# EAGLE board speakerbadge (EAGLE 5.11), part 1 of 2
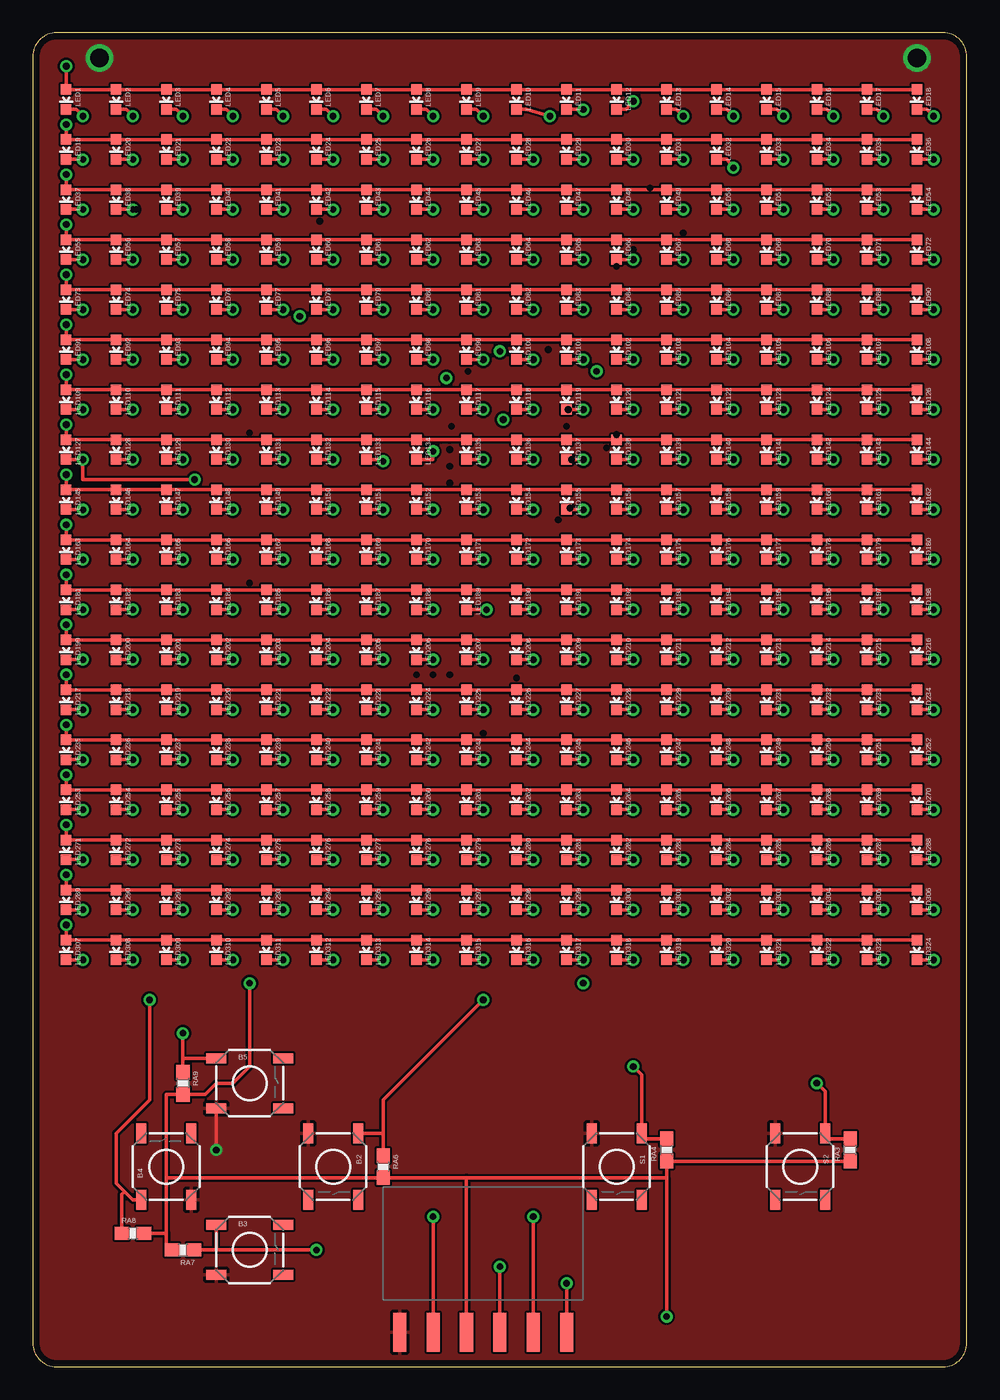
[diagram p2: board, top side]
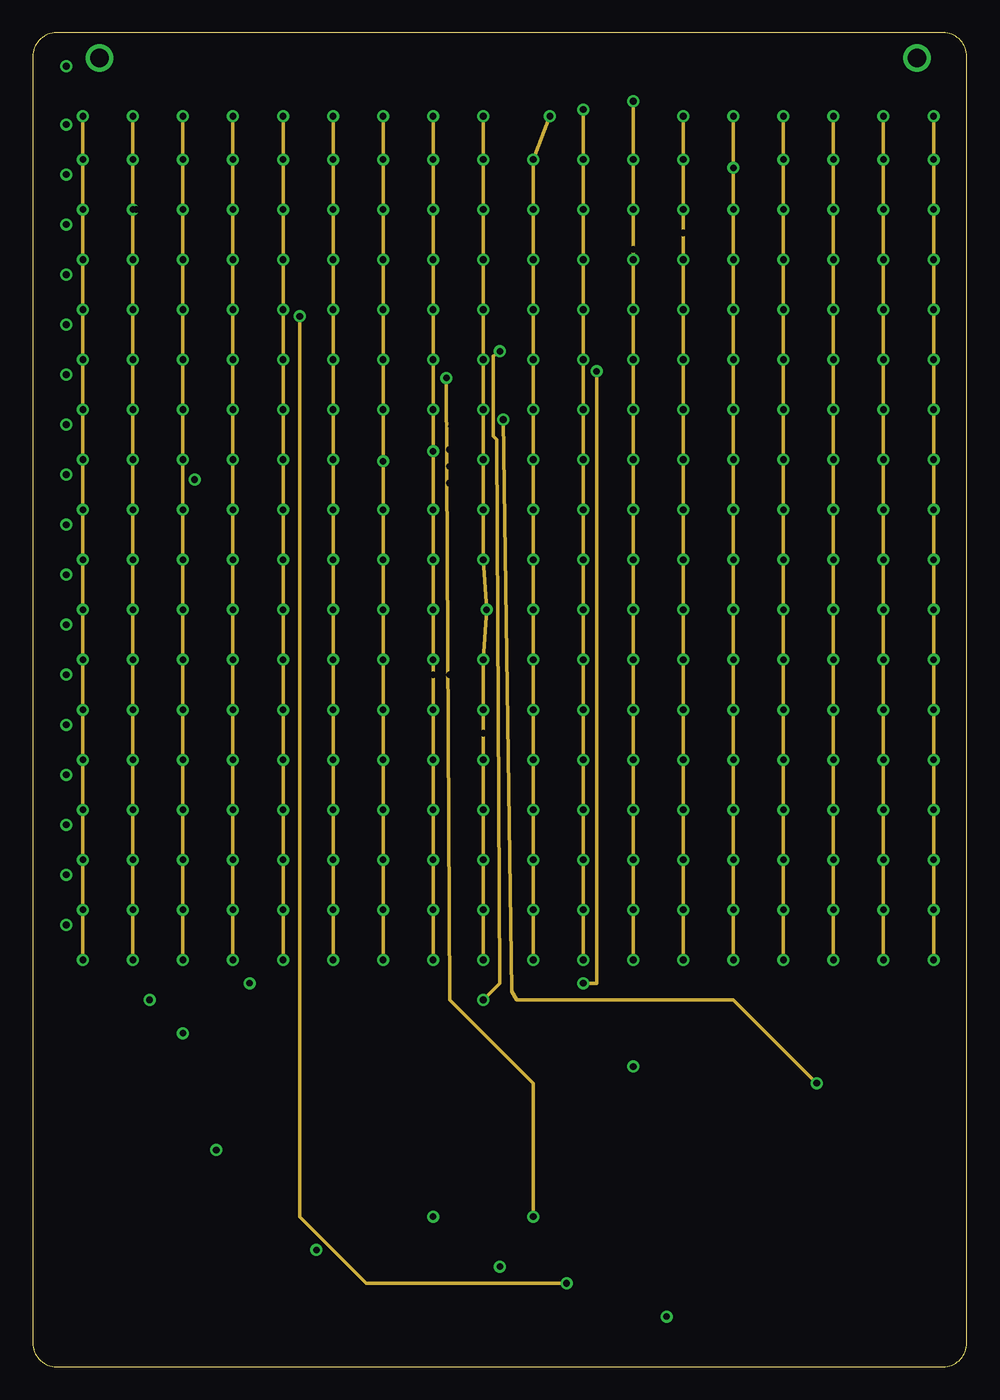
[diagram p3: board, inner layer gnd]
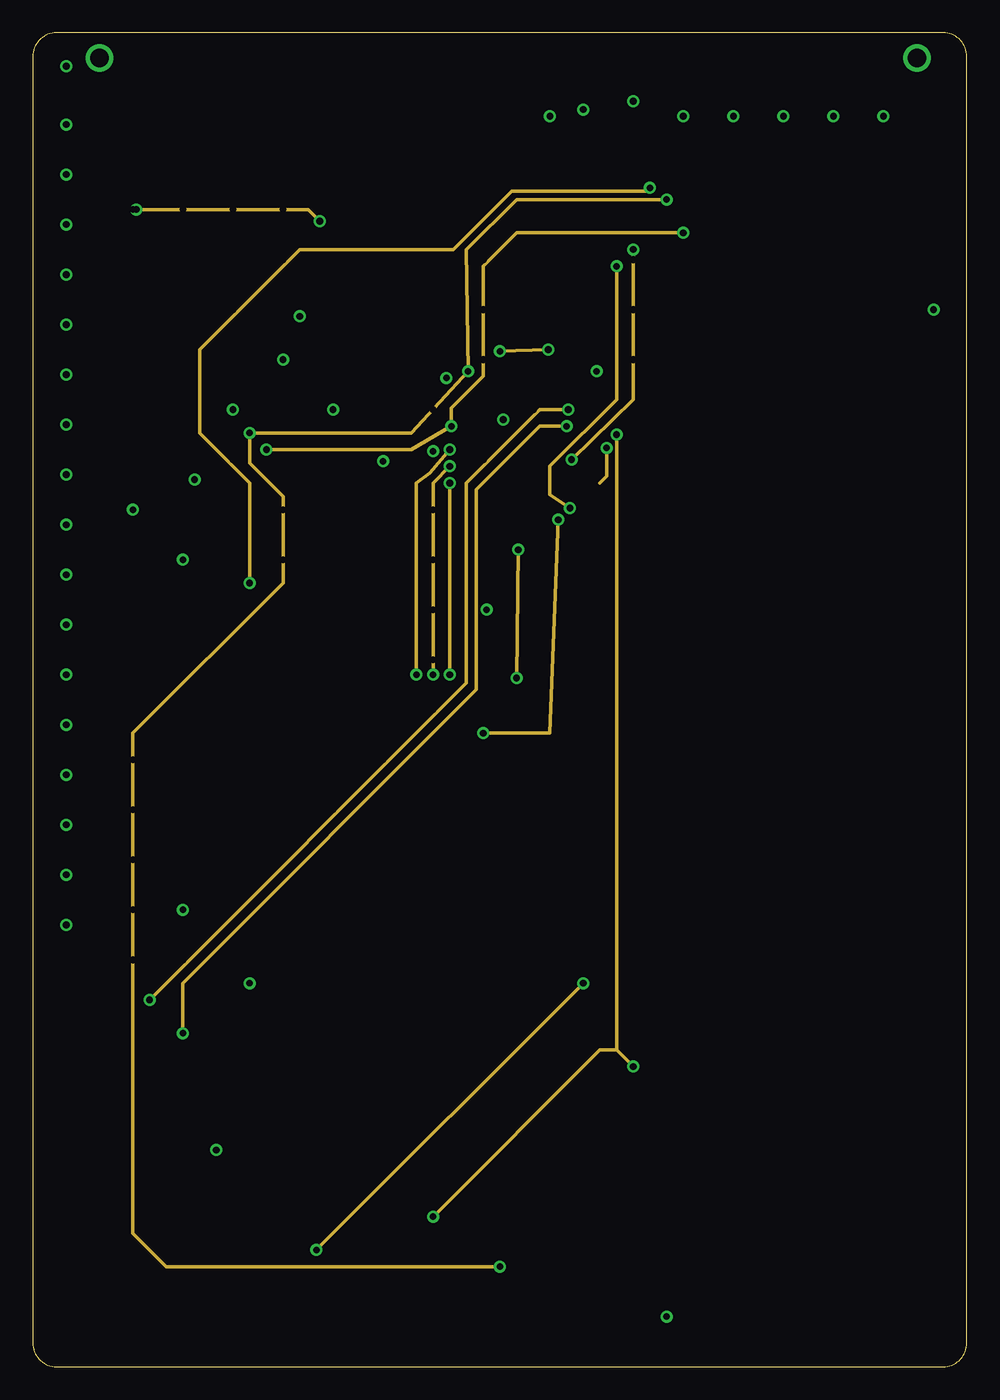
[diagram p4: board, inner layer vcc]
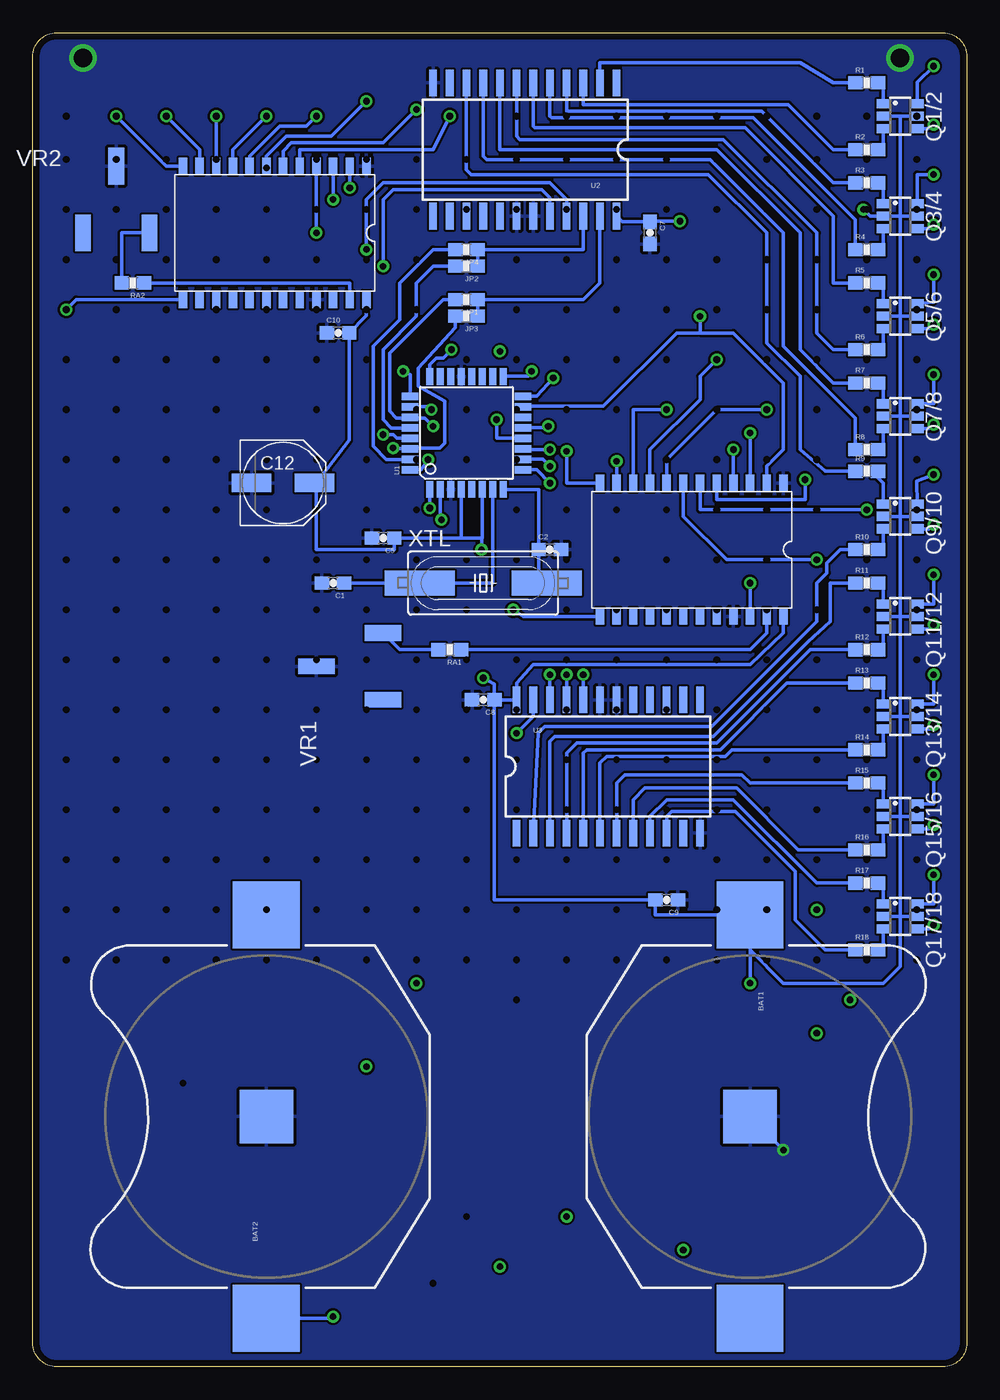
[diagram p5: board, bottom side, seen from below]

Size 71.12 x 101.6 mm. Coordinates in mm from the lower left corner, seen from the top.
Outline: 69.32,0 arc90 71.12,1.8 71.12,99.8 arc90 69.32,101.6 1.8,101.6 arc90 0,99.8 0,1.8 arc90 1.8,0 69.32,0
Copper layers ((1*2)*(3*16)): Top 0.0356mm / dielectric 1.5011mm / gnd 0.0356mm / dielectric 0.1499mm / vcc 0.0356mm / dielectric 0.2007mm / Bottom 0.0356mm
Design rules "SilverCircuits4layer": minimum track width 7mil, minimum drill 14mil, track to track 7mil, track to pad 7mil, pad to pad 7mil, via to via 7mil, smd to smd 0mil, copper to edge 20mil, drill to drill 8mil, minimum pad ring 10mil, minimum via ring 8mil, stop-mask expansion 4mil, vias tented up to drill 0mil, thermal gap 10mil

## Footprints (pad centres in the part's own frame; a part is rotated, then mirrored left to right if it is on the bottom)
TACTILE_SWITCH_SMD = smd 1.524 x 0.762: 1 -2.54,1.905; 2 2.54,1.905; 3 -2.54,-1.905; 4 2.54,-1.905
NSL_SPARKFUN_BATTCON_245MM = smd 5.08 x 5.08: 1 -15.367,0; 3 15.367,0 | smd 4.064 x 4.064: 2 0,0
SPARKFUN_0603-CAP = smd 1.1 x 1: 1 -0.85,0; 2 0.85,0
PANASONIC_D = smd 3 x 1.4: + 2.4,0; - -2.4,0
SPARKFUN_0603-RES = smd 1.1 x 1: 1 -0.85,0; 2 0.85,0
1X06-SMD_EDGE = smd 1 x 3: 1 0,-0.08; 2 2.54,-0.08; 3 5.08,-0.08; 4 7.62,-0.08; 5 10.16,-0.08; 6 12.7,-0.08
NSL_SPARKFUN_LED-0603 = smd 0.8 x 0.8: A 0,-0.75; C 0,0.75
SSOT-6 = smd 0.69 x 0.99: 1 -0.95,-1.3; 2 0,-1.3; 3 0.95,-1.3; 4 0.95,1.3; 5 0,1.3; 6 -0.95,1.3
TQFP32-08 = smd 1.27 x 0.559: 1 -4.293,2.8; 2 -4.293,2; 3 -4.293,1.2; 4 -4.293,0.4; 5 -4.293,-0.4; 6 -4.293,-1.2; 7 -4.293,-2; 8 -4.293,-2.8; 17 4.293,-2.8; 18 4.293,-2; 19 4.293,-1.2; 20 4.293,-0.4; 21 4.293,0.4; 22 4.293,1.2; 23 4.293,2; 24 4.293,2.8 | smd 0.559 x 1.27: 9 -2.8,-4.293; 10 -2,-4.293; 11 -1.2,-4.293; 12 -0.4,-4.293; 13 0.4,-4.293; 14 1.2,-4.293; 15 2,-4.293; 16 2.8,-4.293; 25 2.8,4.293; 26 2,4.293; 27 1.2,4.293; 28 0.4,4.293; 29 -0.4,4.293; 30 -1.2,4.293; 31 -2,4.293; 32 -2.8,4.293
SO-24DW = smd 0.584 x 2.032: 1 -6.35,-5.08; 2 -5.08,-5.08; 3 -3.81,-5.08; 4 -2.54,-5.08; 5 -1.27,-5.08; 6 0,-5.08; 7 1.27,-5.08; 8 2.54,-5.08; 9 3.81,-5.08; 10 5.08,-5.08; 11 6.35,-5.08; 12 7.62,-5.08; 13 7.62,5.08; 14 6.35,5.08; 15 5.08,5.08; 16 3.81,5.08; 17 2.54,5.08; 18 1.27,5.08; 19 0,5.08; 20 -1.27,5.08; 21 -2.54,5.08; 22 -3.81,5.08; 23 -5.08,5.08; 24 -6.35,5.08
STP16DP05MTR = smd 0.635 x 1.27: 1 -7.62,-5.08; 2 -6.35,-5.08; 3 -5.08,-5.08; 4 -3.81,-5.08; 5 -2.54,-5.08; 6 -1.27,-5.08; 7 0,-5.08; 8 1.27,-5.08; 9 2.54,-5.08; 10 3.81,-5.08; 11 5.08,-5.08; 12 6.35,-5.08; 13 6.35,5.08; 14 5.08,5.08; 15 3.81,5.08; 16 2.54,5.08; 17 1.27,5.08; 18 0,5.08; 19 -1.27,5.08; 20 -2.54,5.08; 21 -3.81,5.08; 22 -5.08,5.08; 23 -6.35,5.08; 24 -7.62,5.08
3269W = smd 1.19 x 2.79: 1 -2.54,-2.54; 2 0,2.54; 3 2.54,-2.54
HC49UP = smd 5.334 x 1.93: 1 -4.826,0; 2 4.826,0

## Placement (x,y rotation side)
B2  SWITCH-MOM-2SMD  [TACTILE_SWITCH_SMD]  22.86,15.24 270 top
B3  SWITCH-MOM-2SMD  [TACTILE_SWITCH_SMD]  16.51,8.89 0 top
B4  SWITCH-MOM-2SMD  [TACTILE_SWITCH_SMD]  10.16,15.24 90 top
B5  SWITCH-MOM-2SMD  [TACTILE_SWITCH_SMD]  16.51,21.59 0 top
BAT1  [NSL_SPARKFUN_BATTCON_245MM]  16.51,19.05 270 bottom
BAT2  [NSL_SPARKFUN_BATTCON_245MM]  53.34,19.05 90 bottom
C1  18pF  [SPARKFUN_0603-CAP]  48.26,59.69 180 bottom
C2  18pF  [SPARKFUN_0603-CAP]  31.75,62.23 0 bottom
C5  .1uF  [SPARKFUN_0603-CAP]  44.45,63.12 180 bottom
C7  .1uF  [SPARKFUN_0603-CAP]  24.13,86.36 270 bottom
C8  .1uF  [SPARKFUN_0603-CAP]  36.83,50.8 180 bottom
C9  .1uF  [SPARKFUN_0603-CAP]  22.86,35.56 180 bottom
C10  .1uF  [SPARKFUN_0603-CAP]  47.88,78.74 0 bottom
C12  100uF  [PANASONIC_D]  52.07,67.31 0 bottom
JP1  0ohm  [SPARKFUN_0603-RES]  38.1,81.28 180 bottom
JP2  0ohm  [SPARKFUN_0603-RES]  38.1,83.82 180 bottom
JP3  0ohm  [SPARKFUN_0603-RES]  38.1,80.01 180 bottom
JP4  0ohm  [SPARKFUN_0603-RES]  38.1,85.09 180 bottom
JP5  [1X06-SMD_EDGE]  40.64,2.54 180 top
LED1  [NSL_SPARKFUN_LED-0603]  2.54,96.52 180 top
LED2  [NSL_SPARKFUN_LED-0603]  6.35,96.52 180 top
LED3  [NSL_SPARKFUN_LED-0603]  10.16,96.52 180 top
LED4  [NSL_SPARKFUN_LED-0603]  13.97,96.52 180 top
LED5  [NSL_SPARKFUN_LED-0603]  17.78,96.52 180 top
LED6  [NSL_SPARKFUN_LED-0603]  21.59,96.52 180 top
LED7  [NSL_SPARKFUN_LED-0603]  25.4,96.52 180 top
LED8  [NSL_SPARKFUN_LED-0603]  29.21,96.52 180 top
LED9  [NSL_SPARKFUN_LED-0603]  33.02,96.52 180 top
LED10  [NSL_SPARKFUN_LED-0603]  36.83,96.52 180 top
LED11  [NSL_SPARKFUN_LED-0603]  40.64,96.52 180 top
LED12  [NSL_SPARKFUN_LED-0603]  44.45,96.52 180 top
LED13  [NSL_SPARKFUN_LED-0603]  48.26,96.52 180 top
LED14  [NSL_SPARKFUN_LED-0603]  52.07,96.52 180 top
LED15  [NSL_SPARKFUN_LED-0603]  55.88,96.52 180 top
LED16  [NSL_SPARKFUN_LED-0603]  59.69,96.52 180 top
LED17  [NSL_SPARKFUN_LED-0603]  63.5,96.52 180 top
LED18  [NSL_SPARKFUN_LED-0603]  67.31,96.52 180 top
LED19  [NSL_SPARKFUN_LED-0603]  2.54,92.71 180 top
LED20  [NSL_SPARKFUN_LED-0603]  6.35,92.71 180 top
LED21  [NSL_SPARKFUN_LED-0603]  10.16,92.71 180 top
LED22  [NSL_SPARKFUN_LED-0603]  13.97,92.71 180 top
LED23  [NSL_SPARKFUN_LED-0603]  17.78,92.71 180 top
LED24  [NSL_SPARKFUN_LED-0603]  21.59,92.71 180 top
LED25  [NSL_SPARKFUN_LED-0603]  25.4,92.71 180 top
LED26  [NSL_SPARKFUN_LED-0603]  29.21,92.71 180 top
LED27  [NSL_SPARKFUN_LED-0603]  33.02,92.71 180 top
LED28  [NSL_SPARKFUN_LED-0603]  36.83,92.71 180 top
LED29  [NSL_SPARKFUN_LED-0603]  40.64,92.71 180 top
LED30  [NSL_SPARKFUN_LED-0603]  44.45,92.71 180 top
LED31  [NSL_SPARKFUN_LED-0603]  48.26,92.71 180 top
LED32  [NSL_SPARKFUN_LED-0603]  52.07,92.71 180 top
LED33  [NSL_SPARKFUN_LED-0603]  55.88,92.71 180 top
LED34  [NSL_SPARKFUN_LED-0603]  59.69,92.71 180 top
LED35  [NSL_SPARKFUN_LED-0603]  63.5,92.71 180 top
LED36  [NSL_SPARKFUN_LED-0603]  67.31,92.71 180 top
LED37  [NSL_SPARKFUN_LED-0603]  2.54,88.9 180 top
LED38  [NSL_SPARKFUN_LED-0603]  6.35,88.9 180 top
LED39  [NSL_SPARKFUN_LED-0603]  10.16,88.9 180 top
LED40  [NSL_SPARKFUN_LED-0603]  13.97,88.9 180 top
LED41  [NSL_SPARKFUN_LED-0603]  17.78,88.9 180 top
LED42  [NSL_SPARKFUN_LED-0603]  21.59,88.9 180 top
LED43  [NSL_SPARKFUN_LED-0603]  25.4,88.9 180 top
LED44  [NSL_SPARKFUN_LED-0603]  29.21,88.9 180 top
LED45  [NSL_SPARKFUN_LED-0603]  33.02,88.9 180 top
LED46  [NSL_SPARKFUN_LED-0603]  36.83,88.9 180 top
LED47  [NSL_SPARKFUN_LED-0603]  40.64,88.9 180 top
LED48  [NSL_SPARKFUN_LED-0603]  44.45,88.9 180 top
LED49  [NSL_SPARKFUN_LED-0603]  48.26,88.9 180 top
LED50  [NSL_SPARKFUN_LED-0603]  52.07,88.9 180 top
LED51  [NSL_SPARKFUN_LED-0603]  55.88,88.9 180 top
LED52  [NSL_SPARKFUN_LED-0603]  59.69,88.9 180 top
LED53  [NSL_SPARKFUN_LED-0603]  63.5,88.9 180 top
LED54  [NSL_SPARKFUN_LED-0603]  67.31,88.9 180 top
LED55  [NSL_SPARKFUN_LED-0603]  2.54,85.09 180 top
LED56  [NSL_SPARKFUN_LED-0603]  6.35,85.09 180 top
LED57  [NSL_SPARKFUN_LED-0603]  10.16,85.09 180 top
LED58  [NSL_SPARKFUN_LED-0603]  13.97,85.09 180 top
LED59  [NSL_SPARKFUN_LED-0603]  17.78,85.09 180 top
LED60  [NSL_SPARKFUN_LED-0603]  21.59,85.09 180 top
LED61  [NSL_SPARKFUN_LED-0603]  25.4,85.09 180 top
LED62  [NSL_SPARKFUN_LED-0603]  29.21,85.09 180 top
LED63  [NSL_SPARKFUN_LED-0603]  33.02,85.09 180 top
LED64  [NSL_SPARKFUN_LED-0603]  36.83,85.09 180 top
LED65  [NSL_SPARKFUN_LED-0603]  40.64,85.09 180 top
LED66  [NSL_SPARKFUN_LED-0603]  44.45,85.09 180 top
LED67  [NSL_SPARKFUN_LED-0603]  48.26,85.09 180 top
LED68  [NSL_SPARKFUN_LED-0603]  52.07,85.09 180 top
LED69  [NSL_SPARKFUN_LED-0603]  55.88,85.09 180 top
LED70  [NSL_SPARKFUN_LED-0603]  59.69,85.09 180 top
LED71  [NSL_SPARKFUN_LED-0603]  63.5,85.09 180 top
LED72  [NSL_SPARKFUN_LED-0603]  67.31,85.09 180 top
LED73  [NSL_SPARKFUN_LED-0603]  2.54,81.28 180 top
LED74  [NSL_SPARKFUN_LED-0603]  6.35,81.28 180 top
LED75  [NSL_SPARKFUN_LED-0603]  10.16,81.28 180 top
LED76  [NSL_SPARKFUN_LED-0603]  13.97,81.28 180 top
LED77  [NSL_SPARKFUN_LED-0603]  17.78,81.28 180 top
LED78  [NSL_SPARKFUN_LED-0603]  21.59,81.28 180 top
LED79  [NSL_SPARKFUN_LED-0603]  25.4,81.28 180 top
LED80  [NSL_SPARKFUN_LED-0603]  29.21,81.28 180 top
LED81  [NSL_SPARKFUN_LED-0603]  33.02,81.28 180 top
LED82  [NSL_SPARKFUN_LED-0603]  36.83,81.28 180 top
LED83  [NSL_SPARKFUN_LED-0603]  40.64,81.28 180 top
LED84  [NSL_SPARKFUN_LED-0603]  44.45,81.28 180 top
LED85  [NSL_SPARKFUN_LED-0603]  48.26,81.28 180 top
LED86  [NSL_SPARKFUN_LED-0603]  52.07,81.28 180 top
LED87  [NSL_SPARKFUN_LED-0603]  55.88,81.28 180 top
LED88  [NSL_SPARKFUN_LED-0603]  59.69,81.28 180 top
LED89  [NSL_SPARKFUN_LED-0603]  63.5,81.28 180 top
LED90  [NSL_SPARKFUN_LED-0603]  67.31,81.28 180 top
LED91  [NSL_SPARKFUN_LED-0603]  2.54,77.47 180 top
LED92  [NSL_SPARKFUN_LED-0603]  6.35,77.47 180 top
LED93  [NSL_SPARKFUN_LED-0603]  10.16,77.47 180 top
LED94  [NSL_SPARKFUN_LED-0603]  13.97,77.47 180 top
LED95  [NSL_SPARKFUN_LED-0603]  17.78,77.47 180 top
LED96  [NSL_SPARKFUN_LED-0603]  21.59,77.47 180 top
LED97  [NSL_SPARKFUN_LED-0603]  25.4,77.47 180 top
LED98  [NSL_SPARKFUN_LED-0603]  29.21,77.47 180 top
LED99  [NSL_SPARKFUN_LED-0603]  33.02,77.47 180 top
LED100  [NSL_SPARKFUN_LED-0603]  36.83,77.47 180 top
LED101  [NSL_SPARKFUN_LED-0603]  40.64,77.47 180 top
LED102  [NSL_SPARKFUN_LED-0603]  44.45,77.47 180 top
LED103  [NSL_SPARKFUN_LED-0603]  48.26,77.47 180 top
LED104  [NSL_SPARKFUN_LED-0603]  52.07,77.47 180 top
LED105  [NSL_SPARKFUN_LED-0603]  55.88,77.47 180 top
LED106  [NSL_SPARKFUN_LED-0603]  59.69,77.47 180 top
LED107  [NSL_SPARKFUN_LED-0603]  63.5,77.47 180 top
LED108  [NSL_SPARKFUN_LED-0603]  67.31,77.47 180 top
LED109  [NSL_SPARKFUN_LED-0603]  2.54,73.66 180 top
LED110  [NSL_SPARKFUN_LED-0603]  6.35,73.66 180 top
LED111  [NSL_SPARKFUN_LED-0603]  10.16,73.66 180 top
LED112  [NSL_SPARKFUN_LED-0603]  13.97,73.66 180 top
LED113  [NSL_SPARKFUN_LED-0603]  17.78,73.66 180 top
LED114  [NSL_SPARKFUN_LED-0603]  21.59,73.66 180 top
LED115  [NSL_SPARKFUN_LED-0603]  25.4,73.66 180 top
LED116  [NSL_SPARKFUN_LED-0603]  29.21,73.66 180 top
LED117  [NSL_SPARKFUN_LED-0603]  33.02,73.66 180 top
LED118  [NSL_SPARKFUN_LED-0603]  36.83,73.66 180 top
LED119  [NSL_SPARKFUN_LED-0603]  40.64,73.66 180 top
LED120  [NSL_SPARKFUN_LED-0603]  44.45,73.66 180 top
LED121  [NSL_SPARKFUN_LED-0603]  48.26,73.66 180 top
LED122  [NSL_SPARKFUN_LED-0603]  52.07,73.66 180 top
LED123  [NSL_SPARKFUN_LED-0603]  55.88,73.66 180 top
LED124  [NSL_SPARKFUN_LED-0603]  59.69,73.66 180 top
LED125  [NSL_SPARKFUN_LED-0603]  63.5,73.66 180 top
LED126  [NSL_SPARKFUN_LED-0603]  67.31,73.66 180 top
LED127  [NSL_SPARKFUN_LED-0603]  2.54,69.85 180 top
LED128  [NSL_SPARKFUN_LED-0603]  6.35,69.85 180 top
LED129  [NSL_SPARKFUN_LED-0603]  10.16,69.85 180 top
LED130  [NSL_SPARKFUN_LED-0603]  13.97,69.85 180 top
LED131  [NSL_SPARKFUN_LED-0603]  17.78,69.85 180 top
LED132  [NSL_SPARKFUN_LED-0603]  21.59,69.85 180 top
LED133  [NSL_SPARKFUN_LED-0603]  25.4,69.85 180 top
LED134  [NSL_SPARKFUN_LED-0603]  29.21,69.85 180 top
LED135  [NSL_SPARKFUN_LED-0603]  33.02,69.85 180 top
LED136  [NSL_SPARKFUN_LED-0603]  36.83,69.85 180 top
LED137  [NSL_SPARKFUN_LED-0603]  40.64,69.85 180 top
LED138  [NSL_SPARKFUN_LED-0603]  44.45,69.85 180 top
LED139  [NSL_SPARKFUN_LED-0603]  48.26,69.85 180 top
LED140  [NSL_SPARKFUN_LED-0603]  52.07,69.85 180 top
LED141  [NSL_SPARKFUN_LED-0603]  55.88,69.85 180 top
LED142  [NSL_SPARKFUN_LED-0603]  59.69,69.85 180 top
LED143  [NSL_SPARKFUN_LED-0603]  63.5,69.85 180 top
LED144  [NSL_SPARKFUN_LED-0603]  67.31,69.85 180 top
LED145  [NSL_SPARKFUN_LED-0603]  2.54,66.04 180 top
LED146  [NSL_SPARKFUN_LED-0603]  6.35,66.04 180 top
LED147  [NSL_SPARKFUN_LED-0603]  10.16,66.04 180 top
LED148  [NSL_SPARKFUN_LED-0603]  13.97,66.04 180 top
LED149  [NSL_SPARKFUN_LED-0603]  17.78,66.04 180 top
LED150  [NSL_SPARKFUN_LED-0603]  21.59,66.04 180 top
LED151  [NSL_SPARKFUN_LED-0603]  25.4,66.04 180 top
LED152  [NSL_SPARKFUN_LED-0603]  29.21,66.04 180 top
LED153  [NSL_SPARKFUN_LED-0603]  33.02,66.04 180 top
LED154  [NSL_SPARKFUN_LED-0603]  36.83,66.04 180 top
LED155  [NSL_SPARKFUN_LED-0603]  40.64,66.04 180 top
LED156  [NSL_SPARKFUN_LED-0603]  44.45,66.04 180 top
LED157  [NSL_SPARKFUN_LED-0603]  48.26,66.04 180 top
LED158  [NSL_SPARKFUN_LED-0603]  52.07,66.04 180 top
LED159  [NSL_SPARKFUN_LED-0603]  55.88,66.04 180 top
LED160  [NSL_SPARKFUN_LED-0603]  59.69,66.04 180 top
LED161  [NSL_SPARKFUN_LED-0603]  63.5,66.04 180 top
LED162  [NSL_SPARKFUN_LED-0603]  67.31,66.04 180 top
LED163  [NSL_SPARKFUN_LED-0603]  2.54,62.23 180 top
LED164  [NSL_SPARKFUN_LED-0603]  6.35,62.23 180 top
LED165  [NSL_SPARKFUN_LED-0603]  10.16,62.23 180 top
LED166  [NSL_SPARKFUN_LED-0603]  13.97,62.23 180 top
LED167  [NSL_SPARKFUN_LED-0603]  17.78,62.23 180 top
LED168  [NSL_SPARKFUN_LED-0603]  21.59,62.23 180 top
LED169  [NSL_SPARKFUN_LED-0603]  25.4,62.23 180 top
LED170  [NSL_SPARKFUN_LED-0603]  29.21,62.23 180 top
LED171  [NSL_SPARKFUN_LED-0603]  33.02,62.23 180 top
LED172  [NSL_SPARKFUN_LED-0603]  36.83,62.23 180 top
LED173  [NSL_SPARKFUN_LED-0603]  40.64,62.23 180 top
LED174  [NSL_SPARKFUN_LED-0603]  44.45,62.23 180 top
LED175  [NSL_SPARKFUN_LED-0603]  48.26,62.23 180 top
LED176  [NSL_SPARKFUN_LED-0603]  52.07,62.23 180 top
LED177  [NSL_SPARKFUN_LED-0603]  55.88,62.23 180 top
LED178  [NSL_SPARKFUN_LED-0603]  59.69,62.23 180 top
LED179  [NSL_SPARKFUN_LED-0603]  63.5,62.23 180 top
LED180  [NSL_SPARKFUN_LED-0603]  67.31,62.23 180 top
LED181  [NSL_SPARKFUN_LED-0603]  2.54,58.42 180 top
LED182  [NSL_SPARKFUN_LED-0603]  6.35,58.42 180 top
LED183  [NSL_SPARKFUN_LED-0603]  10.16,58.42 180 top
LED184  [NSL_SPARKFUN_LED-0603]  13.97,58.42 180 top
LED185  [NSL_SPARKFUN_LED-0603]  17.78,58.42 180 top
LED186  [NSL_SPARKFUN_LED-0603]  21.59,58.42 180 top
LED187  [NSL_SPARKFUN_LED-0603]  25.4,58.42 180 top
LED188  [NSL_SPARKFUN_LED-0603]  29.21,58.42 180 top
LED189  [NSL_SPARKFUN_LED-0603]  33.02,58.42 180 top
LED190  [NSL_SPARKFUN_LED-0603]  36.83,58.42 180 top
LED191  [NSL_SPARKFUN_LED-0603]  40.64,58.42 180 top
LED192  [NSL_SPARKFUN_LED-0603]  44.45,58.42 180 top
LED193  [NSL_SPARKFUN_LED-0603]  48.26,58.42 180 top
LED194  [NSL_SPARKFUN_LED-0603]  52.07,58.42 180 top
LED195  [NSL_SPARKFUN_LED-0603]  55.88,58.42 180 top
LED196  [NSL_SPARKFUN_LED-0603]  59.69,58.42 180 top
LED197  [NSL_SPARKFUN_LED-0603]  63.5,58.42 180 top
LED198  [NSL_SPARKFUN_LED-0603]  67.31,58.42 180 top
LED199  [NSL_SPARKFUN_LED-0603]  2.54,54.61 180 top
LED200  [NSL_SPARKFUN_LED-0603]  6.35,54.61 180 top
LED201  [NSL_SPARKFUN_LED-0603]  10.16,54.61 180 top
LED202  [NSL_SPARKFUN_LED-0603]  13.97,54.61 180 top
LED203  [NSL_SPARKFUN_LED-0603]  17.78,54.61 180 top
LED204  [NSL_SPARKFUN_LED-0603]  21.59,54.61 180 top
LED205  [NSL_SPARKFUN_LED-0603]  25.4,54.61 180 top
LED206  [NSL_SPARKFUN_LED-0603]  29.21,54.61 180 top
LED207  [NSL_SPARKFUN_LED-0603]  33.02,54.61 180 top
LED208  [NSL_SPARKFUN_LED-0603]  36.83,54.61 180 top
LED209  [NSL_SPARKFUN_LED-0603]  40.64,54.61 180 top
LED210  [NSL_SPARKFUN_LED-0603]  44.45,54.61 180 top
LED211  [NSL_SPARKFUN_LED-0603]  48.26,54.61 180 top
LED212  [NSL_SPARKFUN_LED-0603]  52.07,54.61 180 top
LED213  [NSL_SPARKFUN_LED-0603]  55.88,54.61 180 top
LED214  [NSL_SPARKFUN_LED-0603]  59.69,54.61 180 top
LED215  [NSL_SPARKFUN_LED-0603]  63.5,54.61 180 top
LED216  [NSL_SPARKFUN_LED-0603]  67.31,54.61 180 top
LED217  [NSL_SPARKFUN_LED-0603]  2.54,50.8 180 top
LED218  [NSL_SPARKFUN_LED-0603]  6.35,50.8 180 top
LED219  [NSL_SPARKFUN_LED-0603]  10.16,50.8 180 top
LED220  [NSL_SPARKFUN_LED-0603]  13.97,50.8 180 top
LED221  [NSL_SPARKFUN_LED-0603]  17.78,50.8 180 top
LED222  [NSL_SPARKFUN_LED-0603]  21.59,50.8 180 top
LED223  [NSL_SPARKFUN_LED-0603]  25.4,50.8 180 top
LED224  [NSL_SPARKFUN_LED-0603]  29.21,50.8 180 top
LED225  [NSL_SPARKFUN_LED-0603]  33.02,50.8 180 top
LED226  [NSL_SPARKFUN_LED-0603]  36.83,50.8 180 top
LED227  [NSL_SPARKFUN_LED-0603]  40.64,50.8 180 top
LED228  [NSL_SPARKFUN_LED-0603]  44.45,50.8 180 top
LED229  [NSL_SPARKFUN_LED-0603]  48.26,50.8 180 top
LED230  [NSL_SPARKFUN_LED-0603]  52.07,50.8 180 top
LED231  [NSL_SPARKFUN_LED-0603]  55.88,50.8 180 top
LED232  [NSL_SPARKFUN_LED-0603]  59.69,50.8 180 top
LED233  [NSL_SPARKFUN_LED-0603]  63.5,50.8 180 top
LED234  [NSL_SPARKFUN_LED-0603]  67.31,50.8 180 top
LED235  [NSL_SPARKFUN_LED-0603]  2.54,46.99 180 top
LED236  [NSL_SPARKFUN_LED-0603]  6.35,46.99 180 top
LED237  [NSL_SPARKFUN_LED-0603]  10.16,46.99 180 top
LED238  [NSL_SPARKFUN_LED-0603]  13.97,46.99 180 top
LED239  [NSL_SPARKFUN_LED-0603]  17.78,46.99 180 top
LED240  [NSL_SPARKFUN_LED-0603]  21.59,46.99 180 top
LED241  [NSL_SPARKFUN_LED-0603]  25.4,46.99 180 top
LED242  [NSL_SPARKFUN_LED-0603]  29.21,46.99 180 top
LED243  [NSL_SPARKFUN_LED-0603]  33.02,46.99 180 top
LED244  [NSL_SPARKFUN_LED-0603]  36.83,46.99 180 top
LED245  [NSL_SPARKFUN_LED-0603]  40.64,46.99 180 top
LED246  [NSL_SPARKFUN_LED-0603]  44.45,46.99 180 top
LED247  [NSL_SPARKFUN_LED-0603]  48.26,46.99 180 top
LED248  [NSL_SPARKFUN_LED-0603]  52.07,46.99 180 top
LED249  [NSL_SPARKFUN_LED-0603]  55.88,46.99 180 top
LED250  [NSL_SPARKFUN_LED-0603]  59.69,46.99 180 top
LED251  [NSL_SPARKFUN_LED-0603]  63.5,46.99 180 top
LED252  [NSL_SPARKFUN_LED-0603]  67.31,46.99 180 top
LED253  [NSL_SPARKFUN_LED-0603]  2.54,43.18 180 top
LED254  [NSL_SPARKFUN_LED-0603]  6.35,43.18 180 top
LED255  [NSL_SPARKFUN_LED-0603]  10.16,43.18 180 top
LED256  [NSL_SPARKFUN_LED-0603]  13.97,43.18 180 top
LED257  [NSL_SPARKFUN_LED-0603]  17.78,43.18 180 top
LED258  [NSL_SPARKFUN_LED-0603]  21.59,43.18 180 top
LED259  [NSL_SPARKFUN_LED-0603]  25.4,43.18 180 top
LED260  [NSL_SPARKFUN_LED-0603]  29.21,43.18 180 top
LED261  [NSL_SPARKFUN_LED-0603]  33.02,43.18 180 top
LED262  [NSL_SPARKFUN_LED-0603]  36.83,43.18 180 top
LED263  [NSL_SPARKFUN_LED-0603]  40.64,43.18 180 top
LED264  [NSL_SPARKFUN_LED-0603]  44.45,43.18 180 top
LED265  [NSL_SPARKFUN_LED-0603]  48.26,43.18 180 top
LED266  [NSL_SPARKFUN_LED-0603]  52.07,43.18 180 top
LED267  [NSL_SPARKFUN_LED-0603]  55.88,43.18 180 top
LED268  [NSL_SPARKFUN_LED-0603]  59.69,43.18 180 top
LED269  [NSL_SPARKFUN_LED-0603]  63.5,43.18 180 top
LED270  [NSL_SPARKFUN_LED-0603]  67.31,43.18 180 top
LED271  [NSL_SPARKFUN_LED-0603]  2.54,39.37 180 top
LED272  [NSL_SPARKFUN_LED-0603]  6.35,39.37 180 top
LED273  [NSL_SPARKFUN_LED-0603]  10.16,39.37 180 top
LED274  [NSL_SPARKFUN_LED-0603]  13.97,39.37 180 top
LED275  [NSL_SPARKFUN_LED-0603]  17.78,39.37 180 top
LED276  [NSL_SPARKFUN_LED-0603]  21.59,39.37 180 top
LED277  [NSL_SPARKFUN_LED-0603]  25.4,39.37 180 top
LED278  [NSL_SPARKFUN_LED-0603]  29.21,39.37 180 top
LED279  [NSL_SPARKFUN_LED-0603]  33.02,39.37 180 top
LED280  [NSL_SPARKFUN_LED-0603]  36.83,39.37 180 top
LED281  [NSL_SPARKFUN_LED-0603]  40.64,39.37 180 top
LED282  [NSL_SPARKFUN_LED-0603]  44.45,39.37 180 top
LED283  [NSL_SPARKFUN_LED-0603]  48.26,39.37 180 top
LED284  [NSL_SPARKFUN_LED-0603]  52.07,39.37 180 top
LED285  [NSL_SPARKFUN_LED-0603]  55.88,39.37 180 top
LED286  [NSL_SPARKFUN_LED-0603]  59.69,39.37 180 top
LED287  [NSL_SPARKFUN_LED-0603]  63.5,39.37 180 top
LED288  [NSL_SPARKFUN_LED-0603]  67.31,39.37 180 top
LED289  [NSL_SPARKFUN_LED-0603]  2.54,35.56 180 top
LED290  [NSL_SPARKFUN_LED-0603]  6.35,35.56 180 top
LED291  [NSL_SPARKFUN_LED-0603]  10.16,35.56 180 top
LED292  [NSL_SPARKFUN_LED-0603]  13.97,35.56 180 top
LED293  [NSL_SPARKFUN_LED-0603]  17.78,35.56 180 top
LED294  [NSL_SPARKFUN_LED-0603]  21.59,35.56 180 top
LED295  [NSL_SPARKFUN_LED-0603]  25.4,35.56 180 top
LED296  [NSL_SPARKFUN_LED-0603]  29.21,35.56 180 top
LED297  [NSL_SPARKFUN_LED-0603]  33.02,35.56 180 top
LED298  [NSL_SPARKFUN_LED-0603]  36.83,35.56 180 top
LED299  [NSL_SPARKFUN_LED-0603]  40.64,35.56 180 top
LED300  [NSL_SPARKFUN_LED-0603]  44.45,35.56 180 top
LED301  [NSL_SPARKFUN_LED-0603]  48.26,35.56 180 top
LED302  [NSL_SPARKFUN_LED-0603]  52.07,35.56 180 top
LED303  [NSL_SPARKFUN_LED-0603]  55.88,35.56 180 top
LED304  [NSL_SPARKFUN_LED-0603]  59.69,35.56 180 top
LED305  [NSL_SPARKFUN_LED-0603]  63.5,35.56 180 top
LED306  [NSL_SPARKFUN_LED-0603]  67.31,35.56 180 top
LED307  [NSL_SPARKFUN_LED-0603]  2.54,31.75 180 top
LED308  [NSL_SPARKFUN_LED-0603]  6.35,31.75 180 top
LED309  [NSL_SPARKFUN_LED-0603]  10.16,31.75 180 top
LED310  [NSL_SPARKFUN_LED-0603]  13.97,31.75 180 top
LED311  [NSL_SPARKFUN_LED-0603]  17.78,31.75 180 top
LED312  [NSL_SPARKFUN_LED-0603]  21.59,31.75 180 top
LED313  [NSL_SPARKFUN_LED-0603]  25.4,31.75 180 top
LED314  [NSL_SPARKFUN_LED-0603]  29.21,31.75 180 top
LED315  [NSL_SPARKFUN_LED-0603]  33.02,31.75 180 top
LED316  [NSL_SPARKFUN_LED-0603]  36.83,31.75 180 top
LED317  [NSL_SPARKFUN_LED-0603]  40.64,31.75 180 top
LED318  [NSL_SPARKFUN_LED-0603]  44.45,31.75 180 top
LED319  [NSL_SPARKFUN_LED-0603]  48.26,31.75 180 top
LED320  [NSL_SPARKFUN_LED-0603]  52.07,31.75 180 top
LED321  [NSL_SPARKFUN_LED-0603]  55.88,31.75 180 top
LED322  [NSL_SPARKFUN_LED-0603]  59.69,31.75 180 top
LED323  [NSL_SPARKFUN_LED-0603]  63.5,31.75 180 top
LED324  [NSL_SPARKFUN_LED-0603]  67.31,31.75 180 top
Q1/2  FMB3906SUPERSOT-6  [SSOT-6]  5.08,95.25 270 bottom
Q3/4  FMB3906SUPERSOT-6  [SSOT-6]  5.08,87.63 270 bottom
Q5/6  FMB3906SUPERSOT-6  [SSOT-6]  5.08,80.01 270 bottom
Q7/8  FMB3906SUPERSOT-6  [SSOT-6]  5.08,72.39 270 bottom
Q9/10  FMB3906SUPERSOT-6  [SSOT-6]  5.08,64.77 270 bottom
Q11/12  FMB3906SUPERSOT-6  [SSOT-6]  5.08,57.15 270 bottom
Q13/14  FMB3906SUPERSOT-6  [SSOT-6]  5.08,49.53 270 bottom
Q15/16  FMB3906SUPERSOT-6  [SSOT-6]  5.08,41.91 270 bottom
Q17/18  FMB3906SUPERSOT-6  [SSOT-6]  5.08,34.29 270 bottom
R1  [SPARKFUN_0603-RES]  7.62,97.79 0 bottom
R2  [SPARKFUN_0603-RES]  7.62,92.71 0 bottom
R3  [SPARKFUN_0603-RES]  7.62,90.17 0 bottom
R4  [SPARKFUN_0603-RES]  7.62,85.09 0 bottom
R5  [SPARKFUN_0603-RES]  7.62,82.55 0 bottom
R6  [SPARKFUN_0603-RES]  7.62,77.47 0 bottom
R7  [SPARKFUN_0603-RES]  7.62,74.93 0 bottom
R8  [SPARKFUN_0603-RES]  7.62,69.85 0 bottom
R9  [SPARKFUN_0603-RES]  7.62,68.2 0 bottom
R10  [SPARKFUN_0603-RES]  7.62,62.23 0 bottom
R11  [SPARKFUN_0603-RES]  7.62,59.69 0 bottom
R12  [SPARKFUN_0603-RES]  7.62,54.61 0 bottom
R13  [SPARKFUN_0603-RES]  7.62,52.07 0 bottom
R14  [SPARKFUN_0603-RES]  7.62,46.99 0 bottom
R15  [SPARKFUN_0603-RES]  7.62,44.45 0 bottom
R16  [SPARKFUN_0603-RES]  7.62,39.37 0 bottom
R17  [SPARKFUN_0603-RES]  7.62,36.83 0 bottom
R18  [SPARKFUN_0603-RES]  7.62,31.75 0 bottom
RA1  [SPARKFUN_0603-RES]  39.37,54.61 180 bottom
RA2  [SPARKFUN_0603-RES]  63.5,82.55 180 bottom
RA3  5K  [SPARKFUN_0603-RES]  62.23,16.51 90 top
RA4  10K  [SPARKFUN_0603-RES]  48.26,16.51 90 top
RA6  5k  [SPARKFUN_0603-RES]  26.67,15.24 270 top
RA7  5k  [SPARKFUN_0603-RES]  11.43,8.89 180 top
RA8  5k  [SPARKFUN_0603-RES]  7.62,10.16 0 top
RA9  5k  [SPARKFUN_0603-RES]  11.43,21.59 270 top
S1  SWITCH-MOM-2SMD  [TACTILE_SWITCH_SMD]  44.45,15.24 270 top
S2  SWITCH-MOM-2SMD  [TACTILE_SWITCH_SMD]  58.42,15.24 270 top
U1  ATMEGA168  [TQFP32-08]  38.1,71.12 90 bottom
U2  CD74HC154M  [SO-24DW]  33.02,92.71 180 bottom
U3  CD74HC154M  [SO-24DW]  27.94,45.72 0 bottom
U4  STP16DP05MTR  [STP16DP05MTR]  21.59,62.23 180 bottom
U5  STP16DP05MTR  [STP16DP05MTR]  53.34,86.36 180 bottom
VR1  TRIMPOT3269W  [3269W]  46.99,53.34 90 bottom
VR2  TRIMPOT3269W  [3269W]  64.77,88.9 0 bottom
XTL  16MHZ  [HC49UP]  36.83,59.69 0 bottom